# Altium schematic sheet Fuel-Gauge.SchDoc
size B; SheetNumber: 3; SheetTotal: 17
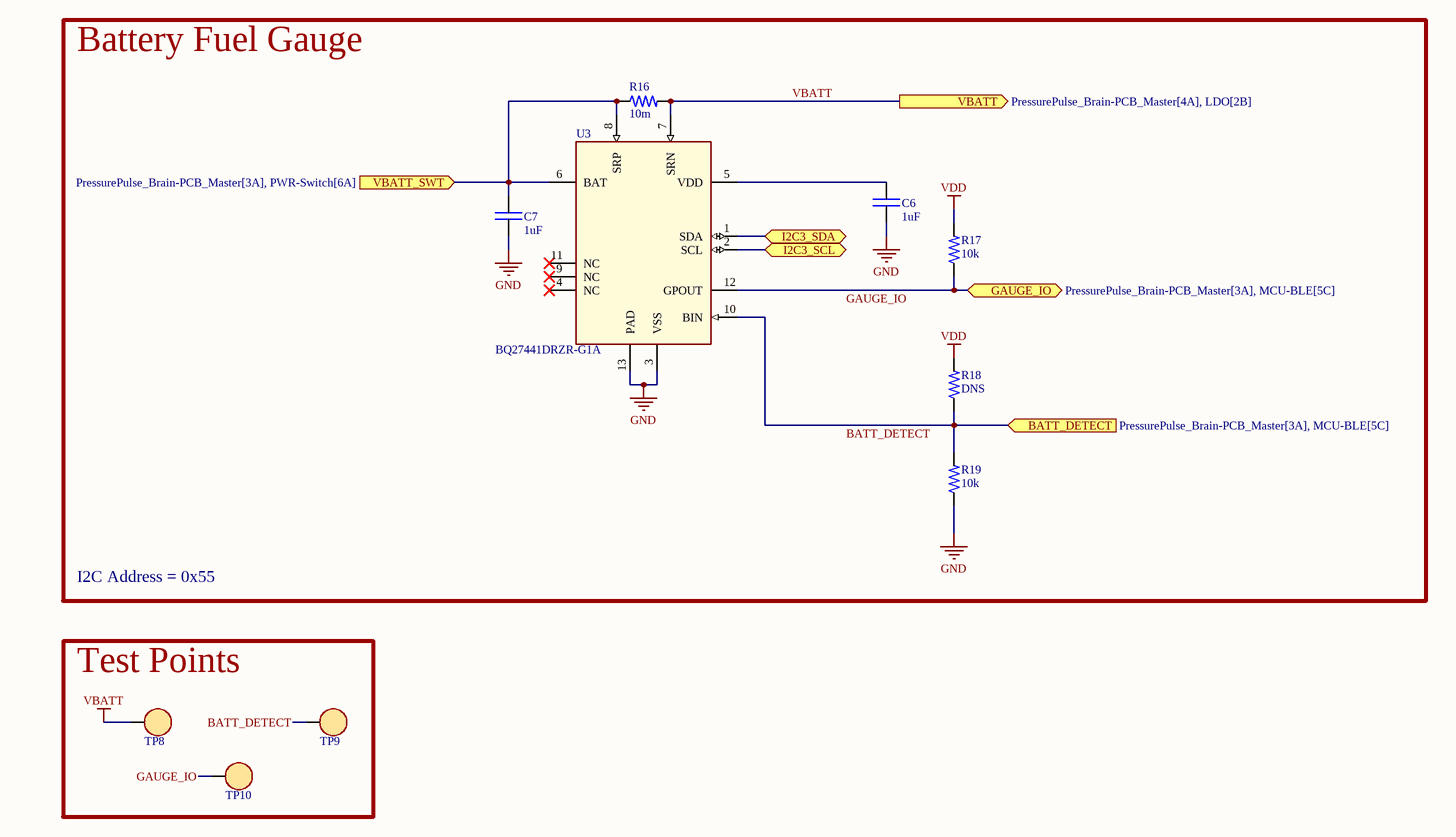
[diagram p0: Fuel-Gauge.SchDoc]

## Parts
C6  value 1uF  [0402C]  (hidden comment: CAP)
C7  value 1uF  [0402C]  (hidden comment: CAP)
R16  value 10m  [2512R]  (hidden comment: RES - CURRENT SENSE)
R17  value 10k  [0402R]  (hidden comment: RES)
R18  value DNS  [0402R]  (hidden comment: RES)
R19  value 10k  [0402R]  (hidden comment: RES)
TP8  RH-5019  [TP - RH-5019]  (value not drawn)
TP9  RH-5019  [TP - RH-5019]  (value not drawn)
TP10  RH-5019  [TP - RH-5019]  (value not drawn)
U3  BQ27441DRZR-G1A  [bq27441-G1]

## Blocks framed on the sheet
Battery Fuel Gauge: C6 C7 R16-R19 U3
Test Points: TP8-TP10

## Ports
BATT_DETECT (in, see PressurePulse_Brain-PCB_Master[3A], MCU-BLE[5C]), GAUGE_IO (bidir, see PressurePulse_Brain-PCB_Master[3A], MCU-BLE[5C]), I2C3_SCL (bidir, see PressurePulse_Brain-PCB_Master[4A], Flow-Sensor[2C], Gyroscope[1C], MCU-BLE[2D], Pressure-Sensor[1C]), I2C3_SDA (bidir, see PressurePulse_Brain-PCB_Master[4A], Flow-Sensor[3C], Gyroscope[1C], MCU-BLE[2D], Pressure-Sensor[3C]), VBATT (out, see PressurePulse_Brain-PCB_Master[4A], LDO[2B]), VBATT_SWT (in, see PressurePulse_Brain-PCB_Master[3A], PWR-Switch[6A])

## Nets
GND: C6.1 C7.1 R19.1 U3.3(VSS) U3.13(PAD)
VBATT: R16.2 TP8.1 U3.7(SRN) ; port VBATT
VDD: R17.2 R18.2
BATT_DETECT: R18.1 R19.2 TP9.1 U3.10(BIN) ; port BATT_DETECT
GAUGE_IO: R17.1 TP10.1 U3.12(GPOUT) ; port GAUGE_IO
I2C3_SCL: U3.2(SCL) ; port I2C3_SCL
I2C3_SDA: U3.1(SDA) ; port I2C3_SDA
VBATT_SWT: C7.2 R16.1 U3.6(BAT) U3.8(SRP) ; port VBATT_SWT
NetC6_2: C6.2 U3.5(VDD)

Not connected (* = marked no-connect by the designer): U3 4(NC)* 9(NC)* 11(NC)*

## Notes on the sheet
- I2C Address = 0x55

## Library data of the parts
C6 C7 = CAP: Capacitor; MFR: *; MFR PN: *; JLCPCB PN: *; Footprint: *
R16 = RES - CURRENT SENSE: 3W 10m Ohm Current Sense Resistor; Tolerance: 1%; MFR PN: *; MFR: *; JLCPCB PN: C429515
R17-R19 = RES: Resistor; MFR PN: *; MFR: *
  R17 R19: JLCPCB PN: C843837
  R18: JLCPCB PN: *
TP8-TP10 = TEST POINT: MFR: ronghe; MFR PN: RH-5019; Value: RH-5019; JLCPCB PN: C5199800
U3 = BATT FUEL GAUGE: No Description Available; MFR: Texas Instruments; Value: BQ27441DRZR-G1A; JLCPCB PN: C473397; MFR PN: BQ27441DRZR-G1A